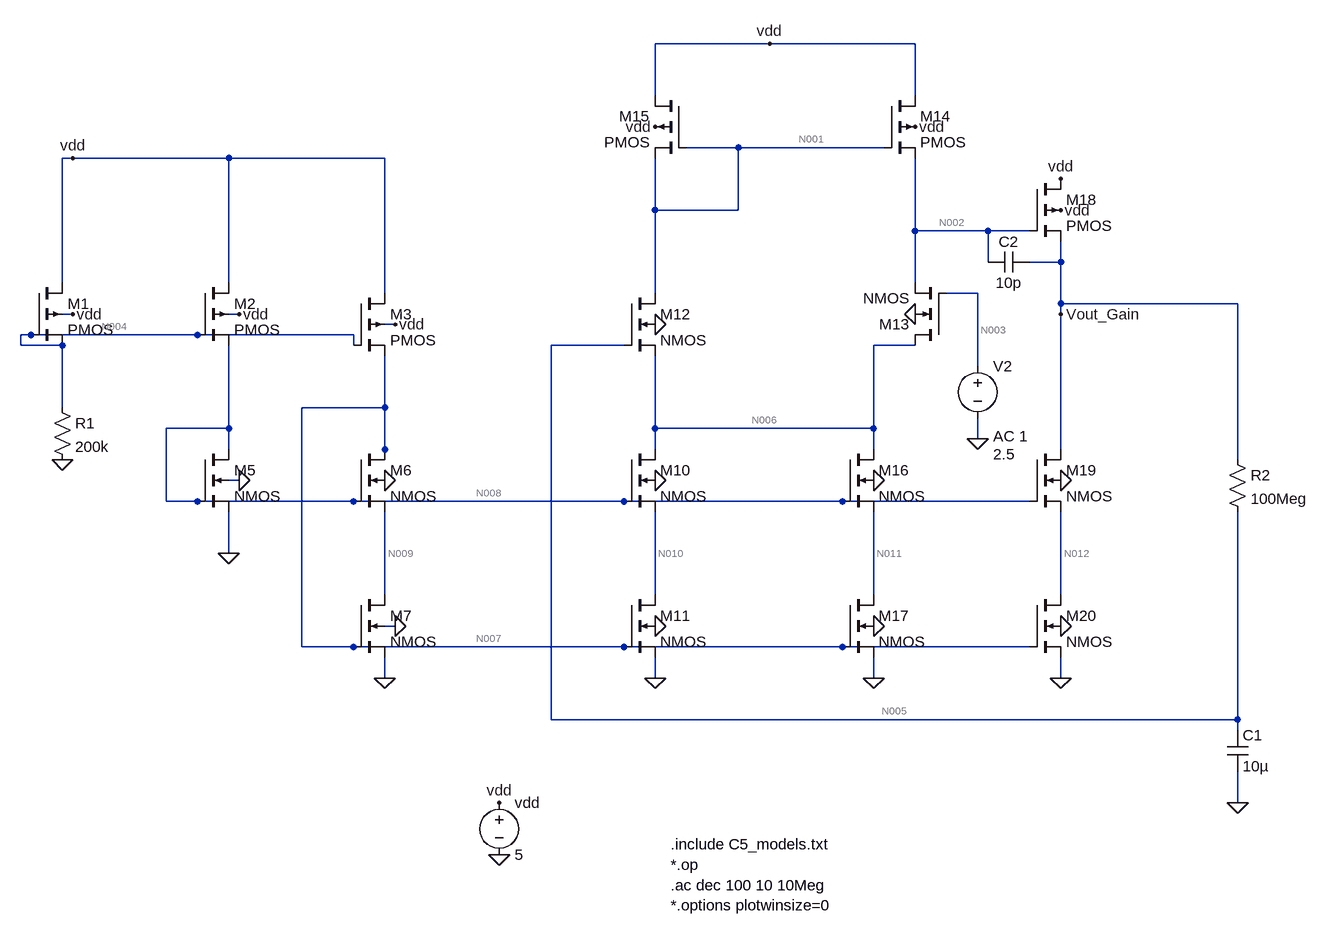
[diagram p0: schematic final (1).asc]
final (1).asc, the LTspice schematic file:
Version 4
SHEET 1 2392 1140
WIRE 1344 -192 1168 -192
WIRE 1568 -192 1344 -192
WIRE 1168 -112 1168 -192
WIRE 1568 -112 1568 -192
WIRE 1296 -32 1216 -32
WIRE 1520 -32 1296 -32
WIRE 272 -16 256 -16
WIRE 512 -16 272 -16
WIRE 752 -16 512 -16
WIRE 1168 64 1168 -16
WIRE 1296 64 1296 -32
WIRE 1296 64 1168 64
WIRE 1568 96 1568 -16
WIRE 1680 96 1568 96
WIRE 1744 96 1680 96
WIRE 1680 144 1680 96
WIRE 1792 144 1792 112
WIRE 1792 144 1744 144
WIRE 256 176 256 -16
WIRE 512 176 512 -16
WIRE 1568 176 1568 96
WIRE 752 192 752 -16
WIRE 1168 192 1168 64
WIRE 1664 192 1616 192
WIRE 1792 208 1792 144
WIRE 2064 208 1792 208
WIRE 272 224 256 224
WIRE 528 224 512 224
WIRE 1792 224 1792 208
WIRE 768 240 752 240
WIRE 208 256 192 256
WIRE 464 256 208 256
WIRE 704 256 464 256
WIRE 192 272 192 256
WIRE 256 272 192 272
WIRE 704 272 704 256
WIRE 1120 272 1008 272
WIRE 1568 272 1504 272
WIRE 1664 304 1664 192
WIRE 256 368 256 272
WIRE 752 368 752 288
WIRE 752 368 624 368
WIRE 512 400 512 272
WIRE 512 400 416 400
WIRE 1168 400 1168 288
WIRE 1504 400 1504 272
WIRE 1504 400 1168 400
WIRE 1664 416 1664 384
WIRE 512 432 512 400
WIRE 752 432 752 368
WIRE 1168 432 1168 400
WIRE 1504 432 1504 400
WIRE 1792 432 1792 224
WIRE 752 448 752 432
WIRE 2064 448 2064 208
WIRE 528 480 512 480
WIRE 416 512 416 400
WIRE 464 512 416 512
WIRE 704 512 464 512
WIRE 1120 512 704 512
WIRE 1456 512 1120 512
WIRE 1744 512 1456 512
WIRE 512 592 512 528
WIRE 752 656 752 528
WIRE 1168 656 1168 528
WIRE 1504 656 1504 528
WIRE 1792 656 1792 528
WIRE 768 704 752 704
WIRE 624 736 624 368
WIRE 704 736 624 736
WIRE 1120 736 704 736
WIRE 1456 736 1120 736
WIRE 1744 736 1456 736
WIRE 752 784 752 752
WIRE 1168 784 1168 752
WIRE 1504 784 1504 752
WIRE 1792 784 1792 752
WIRE 1008 848 1008 272
WIRE 2064 848 2064 528
WIRE 2064 848 1008 848
WIRE 2064 864 2064 848
WIRE 2064 976 2064 928
FLAG 256 448 0
FLAG 272 224 vdd
FLAG 528 224 vdd
FLAG 768 240 vdd
FLAG 528 480 0
FLAG 752 480 0
FLAG 512 592 0
FLAG 752 784 0
FLAG 768 704 0
FLAG 1168 480 0
FLAG 1168 704 0
FLAG 1168 240 0
FLAG 1168 784 0
FLAG 1504 784 0
FLAG 1792 784 0
FLAG 1504 704 0
FLAG 1792 704 0
FLAG 1504 480 0
FLAG 1792 480 0
FLAG 1568 224 0
FLAG 1168 -64 vdd
FLAG 1568 -64 vdd
FLAG 1792 64 vdd
FLAG 1792 16 vdd
FLAG 928 1056 0
FLAG 928 976 vdd
FLAG 272 -16 vdd
FLAG 1344 -192 vdd
FLAG 1664 416 0
FLAG 1792 224 Vout_Gain
FLAG 2064 976 0
SYMBOL res 240 352 R0
SYMATTR InstName R1
SYMATTR Value 200k
SYMBOL pmos4 208 176 R0
SYMATTR InstName M1
SYMATTR Value2 l=5u w=15u
SYMBOL pmos4 464 176 R0
SYMATTR InstName M2
SYMATTR Value2 l=5u w=15u
SYMBOL pmos4 704 192 R0
SYMATTR InstName M3
SYMATTR Value2 l=5u w=15u
SYMBOL nmos4 464 432 R0
SYMATTR InstName M5
SYMATTR Value2 l=5u w=15u
SYMBOL nmos4 704 432 R0
SYMATTR InstName M6
SYMATTR Value2 l=5u w=15u
SYMBOL nmos4 704 656 R0
SYMATTR InstName M7
SYMATTR Value2 l=5u w=15u
SYMBOL nmos4 1120 432 R0
SYMATTR InstName M10
SYMATTR Value2 l=5u w=15u
SYMBOL nmos4 1120 656 R0
SYMATTR InstName M11
SYMATTR Value2 l=5u w=15u
SYMBOL nmos4 1120 192 R0
SYMATTR InstName M12
SYMATTR Value2 l=5u w=15u
SYMBOL nmos4 1616 272 R180
SYMATTR InstName M13
SYMATTR Value2 l=5u w=15u
SYMBOL nmos4 1456 432 R0
SYMATTR InstName M16
SYMATTR Value2 l=2u w=15u
SYMBOL nmos4 1456 656 R0
SYMATTR InstName M17
SYMATTR Value2 l=2u w=15u
SYMBOL nmos4 1744 432 R0
SYMATTR InstName M19
SYMATTR Value2 l=2u w=15u
SYMBOL nmos4 1744 656 R0
SYMATTR InstName M20
SYMATTR Value2 l=2u w=15u
SYMBOL pmos4 1520 -112 R0
SYMATTR InstName M14
SYMATTR Value2 l=5u w=15u
SYMBOL pmos4 1216 -112 M0
SYMATTR InstName M15
SYMATTR Value2 l=5u w=15u
SYMBOL pmos4 1744 16 R0
SYMATTR InstName M18
SYMATTR Value2 l=2u w=15u
SYMBOL voltage 928 960 R0
SYMATTR InstName vdd
SYMATTR Value 5
SYMBOL voltage 1664 288 R0
WINDOW 3 24 152 Left 2
WINDOW 123 24 124 Left 2
WINDOW 39 0 0 Left 0
SYMATTR InstName V2
SYMATTR Value 2.5
SYMATTR Value2 AC 1
SYMBOL cap 1744 128 R90
WINDOW 0 0 32 VBottom 2
WINDOW 3 32 32 VTop 2
SYMATTR InstName C2
SYMATTR Value 10p
SYMBOL res 2048 432 R0
SYMATTR InstName R2
SYMATTR Value 100Meg
SYMBOL cap 2048 864 R0
SYMATTR InstName C1
SYMATTR Value 10µ
TEXT 1192 1040 Left 2 !.include C5_models.txt\n*.op\n.ac dec 100 10 10Meg\n*.options plotwinsize=0

The netlist it stands for:
* final (1).asc
R1 N004 0 200k
M1 vdd N004 N004 vdd PMOS l=5u w=15u
M2 vdd N004 N008 vdd PMOS l=5u w=15u
M3 vdd N004 N007 vdd PMOS l=5u w=15u
M5 N008 N008 0 0 NMOS l=5u w=15u
M6 N007 N008 N009 0 NMOS l=5u w=15u
M7 N009 N007 0 0 NMOS l=5u w=15u
M10 N006 N008 N010 0 NMOS l=5u w=15u
M11 N010 N007 0 0 NMOS l=5u w=15u
M12 N001 N005 N006 0 NMOS l=5u w=15u
M13 N006 N003 N002 0 NMOS l=5u w=15u
M16 N006 N008 N011 0 NMOS l=2u w=15u
M17 N011 N007 0 0 NMOS l=2u w=15u
M19 Vout_Gain N008 N012 0 NMOS l=2u w=15u
M20 N012 N007 0 0 NMOS l=2u w=15u
M14 vdd N001 N002 vdd PMOS l=5u w=15u
M15 vdd N001 N001 vdd PMOS l=5u w=15u
M18 vdd N002 Vout_Gain vdd PMOS l=2u w=15u
vdd vdd 0 5
V2 N003 0 2.5 AC 1
C2 Vout_Gain N002 10p
R2 Vout_Gain N005 100Meg
C1 N005 0 10µ
.model NMOS NMOS
.model PMOS PMOS
.lib standard.mos
.include C5_models.txt
*.op
.ac dec 100 10 10Meg
*.options plotwinsize=0
.backanno
.end

* Results of the author's LTspice run, read from the files saved beside the schematic
* Operating Point, zero values left out:
*   V(vdd) = 5 V
*   V(n007) = 4.492 V
*   V(n009) = 66.02 mV
*   V(n010) = 66.02 mV
*   V(n003) = 2.5 V
*   V(n011) = 66.02 mV
*   V(vout_gain) = 2.535 V
*   V(n004) = 4.167 V
*   V(n008) = 833.3 mV
*   V(n006) = 1.502 V
*   V(n001) = 3.968 V
*   V(n005) = 2.535 V
*   V(n002) = 4.233 V
*   V(n012) = 66.02 mV
*   Id(M5) = 20.83 µA
*   Is(M5) = -20.83 µA
*   Id(M6) = 17.66 µA
*   Is(M6) = -17.66 µA
*   Ib(M6) = -4.577 pA
*   Id(M10) = 17.66 µA
*   Is(M10) = -17.66 µA
*   Ib(M10) = -1.588 pA
*   Id(M13) = -29.86 µA
*   Is(M13) = 29.86 µA
*   Ib(M13) = -5.755 pA
*   Id(M17) = 44.16 µA
*   Is(M17) = -44.16 µA
*   I(vdd) = -165.3 µA
*   I(R1) = 20.83 µA
*   Id(M2) = 20.83 µA
*   Is(M2) = -20.83 µA
*   Ib(M2) = 4.177 pA
*   Id(M19) = 44.16 µA
*   Is(M19) = -44.16 µA
*   Ib(M19) = -2.62 pA
*   Id(M14) = 29.86 µA
*   Is(M14) = -29.86 µA
*   Id(M1) = 20.83 µA
*   Is(M1) = -20.83 µA
*   Id(M7) = 17.66 µA
*   Is(M7) = -17.66 µA
*   Id(M11) = 17.66 µA
*   Is(M11) = -17.66 µA
*   Id(M20) = 44.16 µA
*   Is(M20) = -44.16 µA
*   Id(M15) = 31.96 µA
*   Is(M15) = -31.96 µA
*   Ib(M15) = 1.042 pA
*   Id(M18) = 44.16 µA
*   Is(M18) = -44.16 µA
*   Ib(M18) = 2.475 pA
*   Id(M3) = 17.66 µA
*   Is(M3) = -17.66 µA
*   Id(M12) = 31.96 µA
*   Is(M12) = -31.96 µA
*   Ib(M12) = -5.49 pA
*   Id(M16) = 44.16 µA
*   Is(M16) = -44.16 µA
*   Ib(M16) = -1.588 pA
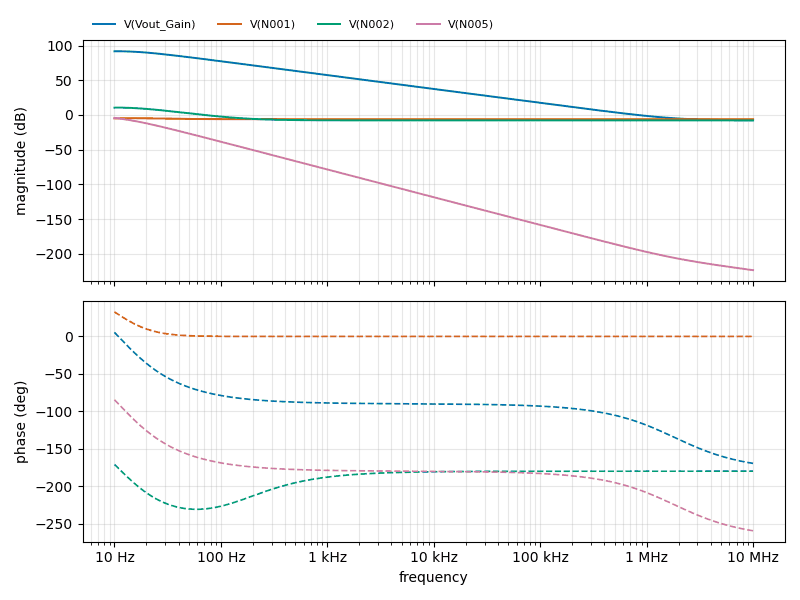
[diagram p1: AC Analysis of final (1).asc, plotted from the saved traces]
* AC Analysis, 1 run:
*   V(Vout_Gain): 91.65 dB at 10 Hz, -7.71 dB at 10 MHz, peak 91.69 dB at 10.96 Hz, 3 dB below the peak at 24.19 Hz
*   V(N001): -5.18 dB at 10 Hz, -6.17 dB at 10 MHz, peak -4.67 dB at 14.79 Hz
*   V(N002): 10.45 dB at 10 Hz, -7.85 dB at 10 MHz, peak 10.49 dB at 10.96 Hz, 3 dB below the peak at 24.5 Hz
*   V(N005): -4.31 dB at 10 Hz, -223.67 dB at 10 MHz, peak -4.31 dB at 10 Hz, 3 dB below the peak at 13.73 Hz